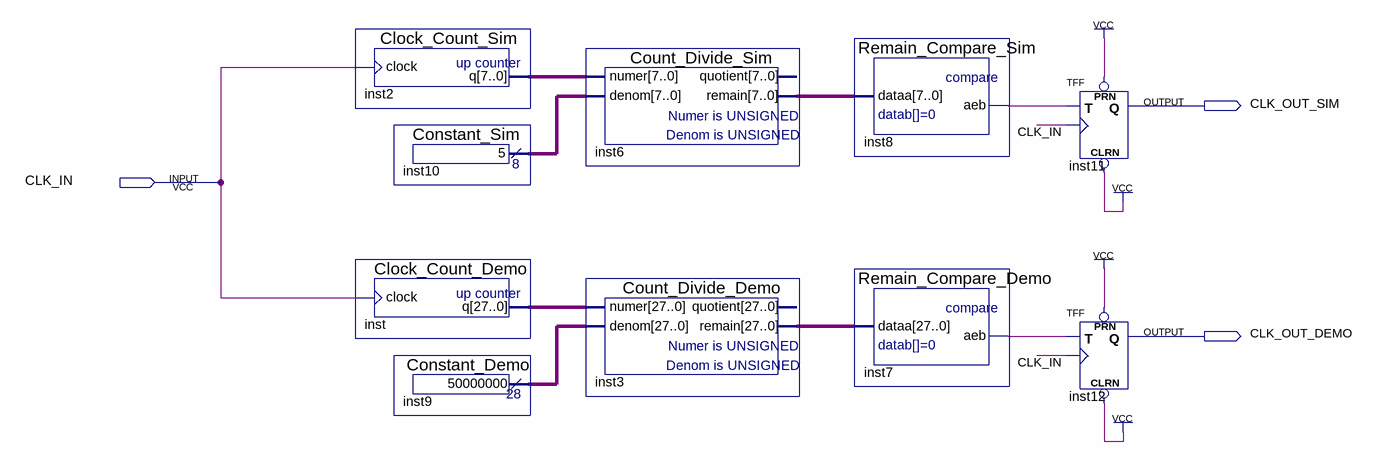
[diagram p0: schematic sheet]
// Quartus schematic CCC.bdf as structural Verilog: 10 symbols, 3 pins
module CCC (
  input  CLK_IN,
  output CLK_OUT_SIM,
  output CLK_OUT_DEMO
);

  wire inst7_aeb, inst8_aeb;
  wire [7:0] inst2_q, inst6_remain, inst10_result;
  wire [27:0] inst3_remain, inst9_result, inst_q;

  Clock_Count_Sim inst2 (.clock(CLK_IN), .q(inst2_q));
  Clock_Count_Demo inst (.clock(CLK_IN), .q(inst_q));
  Constant_Sim inst10 (.result(inst10_result));
  Constant_Demo inst9 (.result(inst9_result));
  Count_Divide_Sim inst6 (.numer(inst2_q), .denom(inst10_result), .remain(inst6_remain));  // open: quotient
  Count_Divide_Demo inst3 (.numer(inst_q), .denom(inst9_result), .remain(inst3_remain));  // open: quotient
  Remain_Compare_Sim inst8 (.dataa(inst6_remain), .aeb(inst8_aeb));
  Remain_Compare_Demo inst7 (.dataa(inst3_remain), .aeb(inst7_aeb));
  TFF inst11 (.PRN(1'b1), .CLRN(1'b1), .T(inst8_aeb), .CLK(CLK_IN), .Q(CLK_OUT_SIM));
  TFF inst12 (.PRN(1'b1), .CLRN(1'b1), .T(inst7_aeb), .CLK(CLK_IN), .Q(CLK_OUT_DEMO));
endmodule
